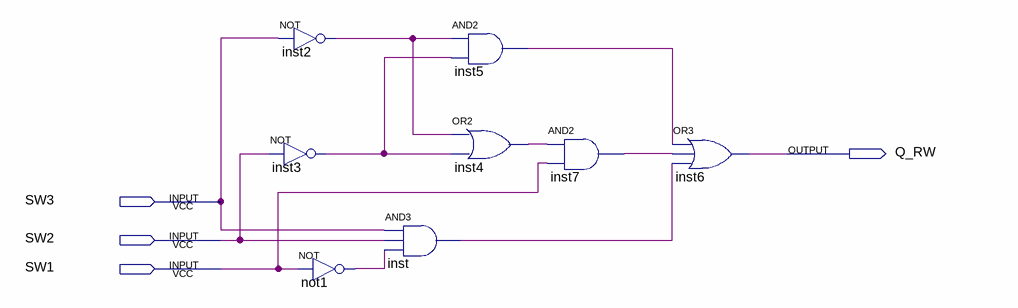
[diagram p0: schematic sheet]
// Quartus schematic q_rw.bdf as structural Verilog: 8 symbols, 4 pins
module q_rw (
  input  SW3,
  input  SW2,
  input  SW1,
  output Q_RW
);

  wire inst2_out, inst3_out, inst4_out, inst5_out, inst7_out, inst_out, not1_out;

  not inst2 (inst2_out, SW3);
  not inst3 (inst3_out, SW2);
  not not1 (not1_out, SW1);
  and inst5 (inst5_out, inst2_out, inst3_out);
  or inst4 (inst4_out, inst2_out, inst3_out);
  and inst (inst_out, SW3, SW2, not1_out);
  and inst7 (inst7_out, inst4_out, SW1);
  or inst6 (Q_RW, inst5_out, inst7_out, inst_out);
endmodule
